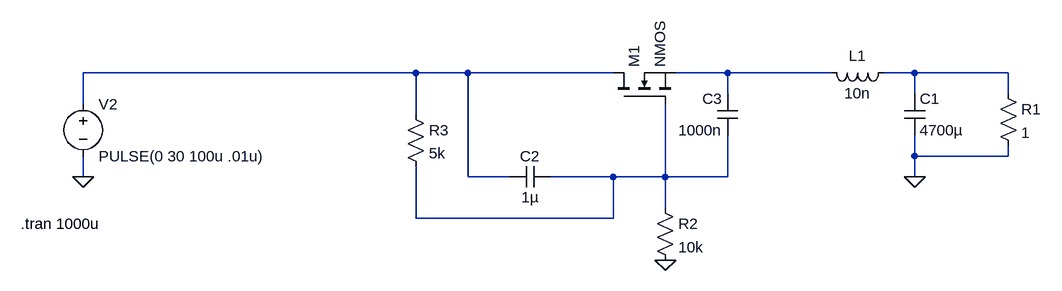
[diagram p0: schematic InrushCurrentLimiter.asc]
InrushCurrentLimiter.asc, the LTspice schematic file:
Version 4.1
SHEET 1 880 680
WIRE -304 144 -816 144
WIRE -224 144 -304 144
WIRE 0 144 -224 144
WIRE 176 144 96 144
WIRE 336 144 176 144
WIRE 464 144 416 144
WIRE 608 144 464 144
WIRE 176 176 176 144
WIRE 464 176 464 144
WIRE 608 176 608 144
WIRE -816 192 -816 144
WIRE -304 208 -304 144
WIRE 464 272 464 240
WIRE 608 272 608 256
WIRE 608 272 464 272
WIRE -816 304 -816 272
WIRE -224 304 -224 144
WIRE -160 304 -224 304
WIRE 0 304 -96 304
WIRE 80 304 80 192
WIRE 80 304 0 304
WIRE 176 304 176 240
WIRE 176 304 80 304
WIRE 464 304 464 272
WIRE 80 352 80 304
WIRE -304 368 -304 288
WIRE 0 368 0 304
WIRE 0 368 -304 368
FLAG 464 304 0
FLAG -816 304 0
FLAG 80 432 0
SYMBOL cap 448 176 R0
SYMATTR InstName C1
SYMATTR Value 4700µ
SYMBOL res 592 160 R0
SYMATTR InstName R1
SYMATTR Value 1
SYMBOL voltage -816 176 R0
WINDOW 123 0 0 Left 0
WINDOW 39 0 0 Left 0
SYMATTR InstName V2
SYMATTR Value PULSE(0 30 100u .01u)
SYMBOL ind 432 128 R90
WINDOW 0 5 56 VBottom 2
WINDOW 3 32 56 VTop 2
SYMATTR InstName L1
SYMATTR Value 10n
SYMATTR SpiceLine Rser=1m
SYMBOL cap -160 320 R270
WINDOW 0 32 32 VTop 2
WINDOW 3 0 32 VBottom 2
SYMATTR InstName C2
SYMATTR Value 1µ
SYMBOL nmos 0 192 R270
SYMATTR InstName M1
SYMBOL cap 192 240 R180
WINDOW 0 24 56 Left 2
WINDOW 3 24 8 Left 2
SYMATTR InstName C3
SYMATTR Value 1000n
SYMBOL res 64 336 R0
SYMATTR InstName R2
SYMATTR Value 10k
SYMBOL res -320 192 R0
SYMATTR InstName R3
SYMATTR Value 5k
TEXT -912 376 Left 2 !.tran 1000u

The netlist it stands for:
* InrushCurrentLimiter.asc
C1 N003 0 4700µ
R1 N003 0 1
V2 N001 0 PULSE(0 30 100u .01u)
L1 N003 N002 10n Rser=1m
C2 N001 N004 1µ
M1 N001 N004 N002 N002 NMOS
C3 N004 N002 1000n
R2 N004 0 10k
R3 N001 N004 5k
.model NMOS NMOS
.model PMOS PMOS
.lib standard.mos
.tran 1000u
.backanno
.end